# EasyEDA schematic reaction-game.json
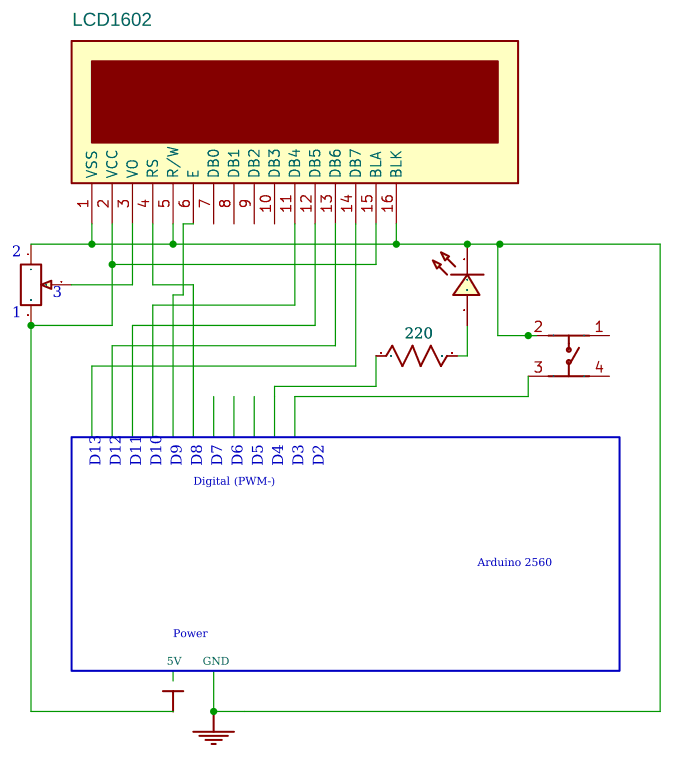
[diagram p0: schematic sheet]

## Parts
KEY1  button6*6*8  [KEY-TH_4P-L6.0-W6.0-P4.50-LS7.5]
LCD1  LCD1602  [LCD1602]
LED1  LED-0603_R  [LED0603_RED]
R1  220  [R0603]
RP1  R_3386P_EU  [RES-ADJ-TH_3386P]

## Library data of the parts
KEY1 = button6*6*8: Supplier Part: C59982; Supplier: LCSC; Manufacturer: ReliaPro
LCD1 = LCD1602: Manufacturer: LONTECH(厦门龙特); Manufacturer Part: LCM1602K-NSW-BBW; Supplier Part: C83275; Supplier: LCSC; Contributor: LCEDA_Lib
LED1 = LED-0603_R: Manufacturer: EVERLIGHT(台湾亿光); Manufacturer Part: 19-217/R6C-AL1M2VY/3T; Supplier Part: C72044; Supplier: LCSC; Contributor: LCEDA_01
R1 = R_0603_US: Contributor: LCEDA_Lib
RP1 = R_3386P_EU: Supplier: LCSC; Contributor: LCEDA_Lib; Value(Ω): 10K

## Nets
5V: LCD1.2(VCC) LCD1.15(BLA) RP1.3
GND: KEY1.2 LCD1.1(VSS) LCD1.5(R/W) LCD1.16(BLK) LED1.2 RP1.1
Net-(LCD1-3): LCD1.3(VO) RP1.2
Net-(LED1-1): LED1.1 R1.2

Not connected (* = marked no-connect by the designer): KEY1 1 3 4; LCD1 4(RS) 6(E) 7(DB0) 8(DB1) 9(DB2) 10(DB3) 11(DB4) 12(DB5) 13(DB6) 14(DB7); R1 1

## Notes on the sheet
- 2
- 3
- 1
- D13
- D12
- D11
- D10
- D9
- D8
- Digital (PWM-)
- D7
- D6
- D5
- D4
- D3
- D2
- Arduino 2560
- Power
